# EAGLE design LCDModule_328p (EAGLE 7.1.0)
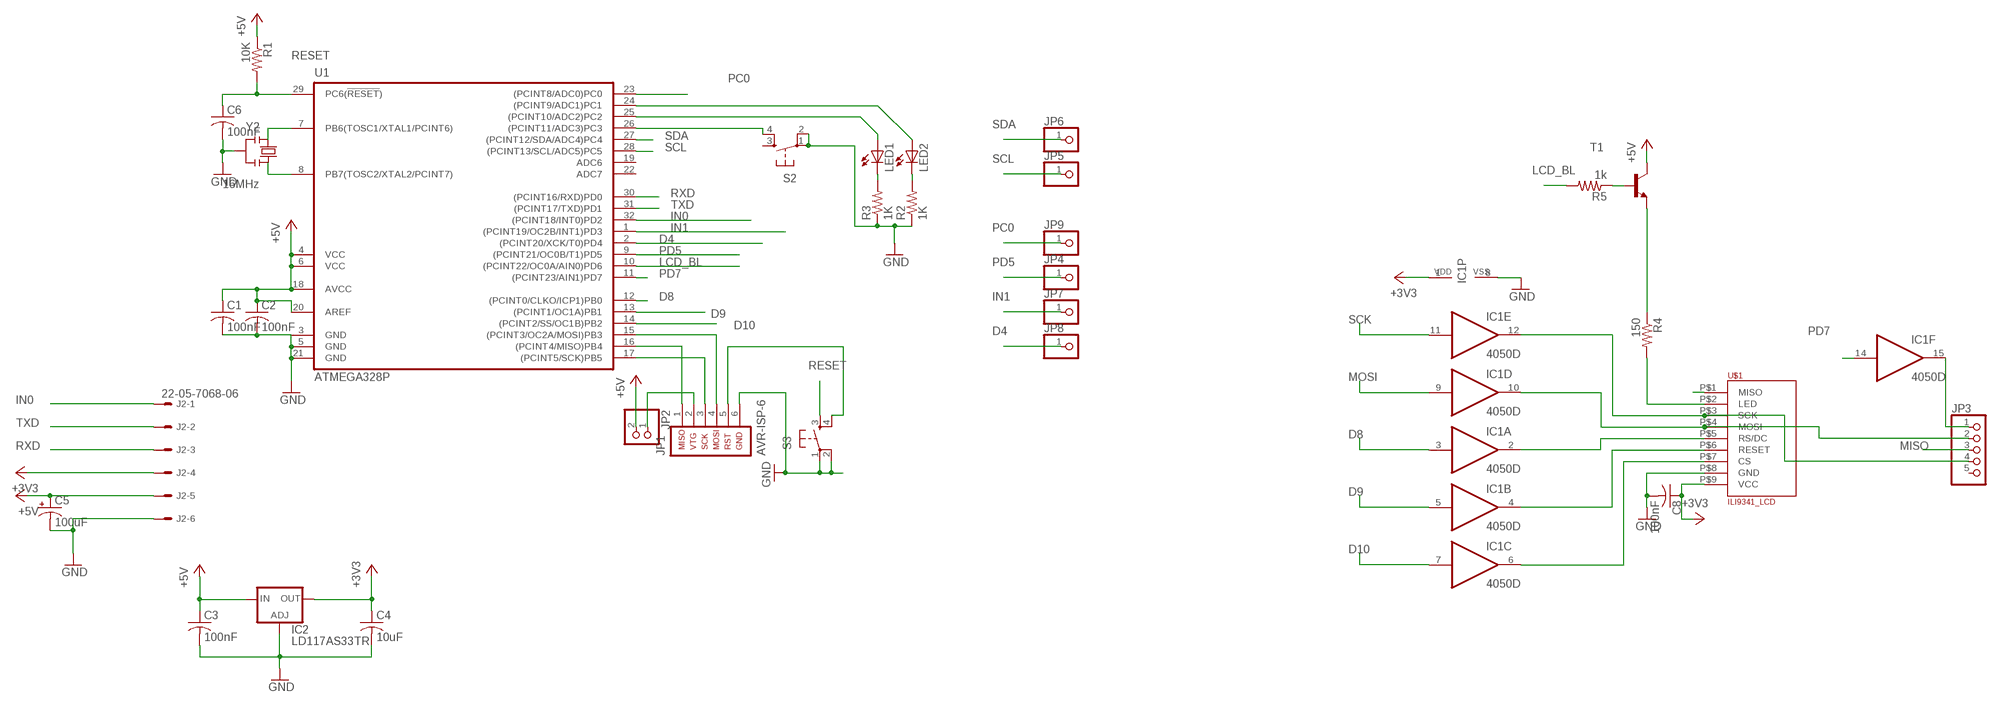
[diagram p0: schematic, sheet 1]

## Parts
C1  100nF  C-USC0805K  [C0805K]
C2  100nF  C-USC0805K  [C0805K]
C3  100nF  C-USC0805K  [C0805K]
C4  10uF  C-USC0805K  [C0805K]
C5  100uF  CPOL-USD  [PANASONIC_D]
C6  100nF  C-USC0805K  [C0805K]
C8  100nF  C-USC0805K  [C0805K]
IC1  4050D  [SO16]
IC2  LD117AS33TR  [SOT223]
J2  22-05-7068-06  [7395-06]
JP1  AVR-ISP-6  [AVR-ISP-6]
JP2  PINHD-1X2  [1X02]
JP3  PINHD-1X5  [1X05]
JP4  PINHD-1X1  [1X01]
JP5  PINHD-1X1  [1X01]
JP6  PINHD-1X1  [1X01]
JP7  PINHD-1X1  [1X01]
JP8  PINHD-1X1  [1X01]
JP9  PINHD-1X1  [1X01]
LED1  LEDCHIPLED_0805  [CHIPLED_0805]
LED2  LEDCHIPLED_0805  [CHIPLED_0805]
R1  10K  R-US_R0805  [R0805]
R2  1K  R-US_R0805  [R0805]
R3  1K  R-US_R0805  [R0805]
R4  150  R-US_R0805  [R0805]
R5  1k  R-US_R0805  [R0805]
S2  TAC_SWITCHSMD  [TACTILE_SWITCH_SMD]
S3  TAC_SWITCHSMD  [TACTILE_SWITCH_SMD]
T1  MMBT2222ALT1-NPN-SOT23-BEC  [SOT23-BEC]
U1  ATMEGA328P  ATMEGA48P/88P/168P/328P-A  [TQFP32A]
U$1  ILI9341_LCD  [SIL1X9]
Y2  16MHz  RESONATORMU  [RESONATOR]

## Nets
+3V3: C4.1 C8.1 IC1.1(P:VDD) IC2.4(OUT) J2.4 U$1.P$9(VCC)
+5V: C1.1 C2.1 C3.1 C5.+ IC2.3(IN) J2.5 JP2.2 R1.1 T1.C U1.4(VCC) U1.6(VCC) U1.18(AVCC) U1.20(AREF)
D4: JP8.1 U1.2((PCINT20/XCK/T0)PD4)
D8: IC1.3(A:I) U1.12((PCINT0/CLKO/ICP1)PB0)
D9: IC1.5(B:I) U1.13((PCINT1/OC1A)PB1)
D10: IC1.7(C:I) U1.14((PCINT2/SS/OC1B)PB2)
GND: C1.2 C2.2 C3.2 C4.2 C5.- C6.2 C8.2 IC1.8(P:VSS) IC2.1(ADJ) J2.6 JP1.6 R2.1 R3.1 S2.1 S2.2 S3.1 S3.2 U1.5(GND) U1.21(GND) U$1.P$8(GND) Y2.2
IN0: J2.1 U1.32((PCINT18/INT0)PD2)
IN1: JP7.1 U1.1((PCINT19/OC2B/INT1)PD3)
LCD_BL: R5.2 U1.10((PCINT22/OC0A/AIN0)PD6)
MISO: JP1.1 JP3.3 U1.16((PCINT4/MISO)PB4)
MOSI: IC1.9(D:I) JP1.4 U1.15((PCINT3/OC2A/MOSI)PB3)
N$1: R5.1 T1.B
N$2: LED2.A U1.24((PCINT9/ADC1)PC1)
N$3: LED1.A U1.25((PCINT10/ADC2)PC2)
N$4: S2.4 U1.26((PCINT11/ADC3)PC3)
N$5: IC1.12(E:O) JP3.4 U$1.P$3(SCK)
N$6: IC1.10(D:O) JP3.2 U$1.P$4(MOSI)
N$7: U$1.P$1(MISO)
N$8: IC1.2(A:O) U$1.P$5(RS/DC)
N$9: U1.8(PB7(TOSC2/XTAL2/PCINT7)) Y2.3
N$10: U1.7(PB6(TOSC1/XTAL1/PCINT6)) Y2.1
N$12: LED2.C R2.2
N$13: LED1.C R3.2
N$14: IC1.4(B:O) U$1.P$6(RESET)
N$15: IC1.6(C:O) U$1.P$7(CS)
N$16: IC1.15(F:O) JP3.1
N$17: R4.1 T1.E
N$18: R4.2 U$1.P$2(LED)
N$19: JP1.5 S3.4
N$20: JP1.2 JP2.1
PC0: JP9.1 U1.23((PCINT8/ADC0)PC0)
PD5: JP4.1 U1.9((PCINT21/OC0B/T1)PD5)
PD7: IC1.14(F:I) U1.11((PCINT23/AIN1)PD7)
RESET: C6.1 R1.2 S3.3 U1.29(PC6(!RESET!))
RXD: J2.3 U1.30((PCINT16/RXD)PD0)
SCK: IC1.11(E:I) JP1.3 U1.17((PCINT5/SCK)PB5)
SCL: JP5.1 U1.28((PCINT13/SCL/ADC5)PC5)
SDA: JP6.1 U1.27((PCINT12/SDA/ADC4)PC4)
TXD: J2.2 U1.31((PCINT17/TXD)PD1)
Unconnected: JP3.5 S2.3 U1.19(ADC6) U1.22(ADC7)

## Power pins joined to a net without a drawn wire
GND: U1.3(GND)

## Library data of the parts
C1-C4 C6 C8 = resistor:C-US: CAPACITOR, American symbol
C5 = resistor:CPOL-US: POLARIZED CAPACITOR, American symbol
IC1 = 40xx:4050: Hex non-inverting BUFFER
IC2 = v-reg:LD117A?*: Low drop fixed and adjustable positive voltage regulators 1 A Source: http://www.st.com/stonline/products/literature/ds/7194/ld1117axx.pdf
J2 = con-molex:22-?-06: CONNECTOR wire to board 2.54 mm (.1 inch) pitch header; OC_FARNELL: unknown; OC_NEWARK: unknown
JP1 = atmel:AVR-ISP-6: AVR ISP-6 Serial Programming Header
JP2 = pinhead:PINHD-1X2: PIN HEADER
JP3 = pinhead:PINHD-1X5: PIN HEADER
JP4-JP9 = pinhead:PINHD-1X1: PIN HEADER
LED1 LED2 = led:LED: LED OSRAM: - CHIPLED LG R971, LG N971, LY N971, LG Q971, LY Q971, LO R971, LY R971 LH N974, LH R974 LS Q976, LO Q976, LY Q976 LO Q996 - Hyper CHIPLED LW Q18S LB Q993, LB Q99A, LB R99A - SideLED LS A670, LO A670, LY A670, LG A670, LP A670 LB A673, LV A673, LT A673, LW A673 LH A674 LY A675 LS A676, LA A676, LO A676, LY A676, LW A676 LS A679, LY A679, LG A679 - Hyper Micro SIDELED® LS Y876, LA Y876, LO Y876, LY Y876 LT Y87S - SmartLED LW L88C, LW L88S LB L89C, LB L89S, LG L890 LS L89K, LO L89K, LY L89K LS L896, LA L896, LO L896, LY L896 - TOPLED LS T670, LO T670, LY T670, LG T670, LP T670 LSG T670, LSP T670, LSY T670, LOP T670, LYG T670 LG T671, LOG T671, LSG T671 LB T673, LV T673, LT T673, LW T673 LH T674 LS T676, LA T676, LO T676, LY T676, LB T676, LH T676, LSB T676, LW T676 LB T67C, LV T67C, LT T67C, LS T67K, LO T67K, LY T67K, LW E67C LS E67B, LA E67B, LO E67B, LY E67B, LB E67C, LV E67C, LT E67C LW T67C LS T679, LY T679, LG T679 LS T770, LO T770, LY T770, LG T770, LP T770 LB T773, LV T773, LT T773, LW T773 LH T774 LS E675, LA E675, LY E675, LS T675 LS T776, LA T776, LO T776, LY T776, LB T776 LHGB T686 LT T68C, LB T68C - Hyper Mini TOPLED® LB M676 - Mini TOPLED Santana® LG M470 LS M47K, LO M47K, LY M47K Source: http://www.osram.convergy.de LUXEON: - LUMILED® LXK2-PW12-R00, LXK2-PW12-S00, LXK2-PW14-U00, LXK2-PW14-V00 LXK2-PM12-R00, LXK2-PM12-S00, LXK2-PM14-U00 LXK2-PE12-Q00, LXK2-PE12-R00, LXK2-PE12-S00, LXK2-PE14-T00, LXK2-PE14-U00 LXK2-PB12-K00, LXK2-PB12-L00, LXK2-PB12-M00, LXK2-PB14-N00, LXK2-PB14-P00, LXK2-PB14-Q00 LXK2-PR12-L00, LXK2-PR12-M00, LXK2-PR14-Q00, LXK2-PR14-R00 LXK2-PD12-Q00, LXK2-PD12-R00, LXK2-PD12-S00 LXK2-PH12-R00, LXK2-PH12-S00 LXK2-PL12-P00, LXK2-PL12-Q00, LXK2-PL12-R00 Source: www.luxeon.com KINGBRIGHT: KA-3528ASYC Source: www.kingbright.com
R1-R5 = resistor:R-US_: RESISTOR, American symbol
S2 S3 = SparkFun:TAC_SWITCH: Momentary Switch Button commonly used for reset or general input. Spark Fun Electronics SKU : COM-00097
T1 = transistor-neu-to92:*-NPN-: NPN Transistror
U1 = atmel-avr:ATMEGA48P/88P/168P/328P: MICROCONTROLLER 4/8/16/32K Flash
U$1 = RobThePyro:ILI9341_LCD
Y2 = SmartPrj:RESONATOR

## Net classes
0 default: width 0.152 mm, drill 0.305 mm, clearance 0.152 mm

## Board
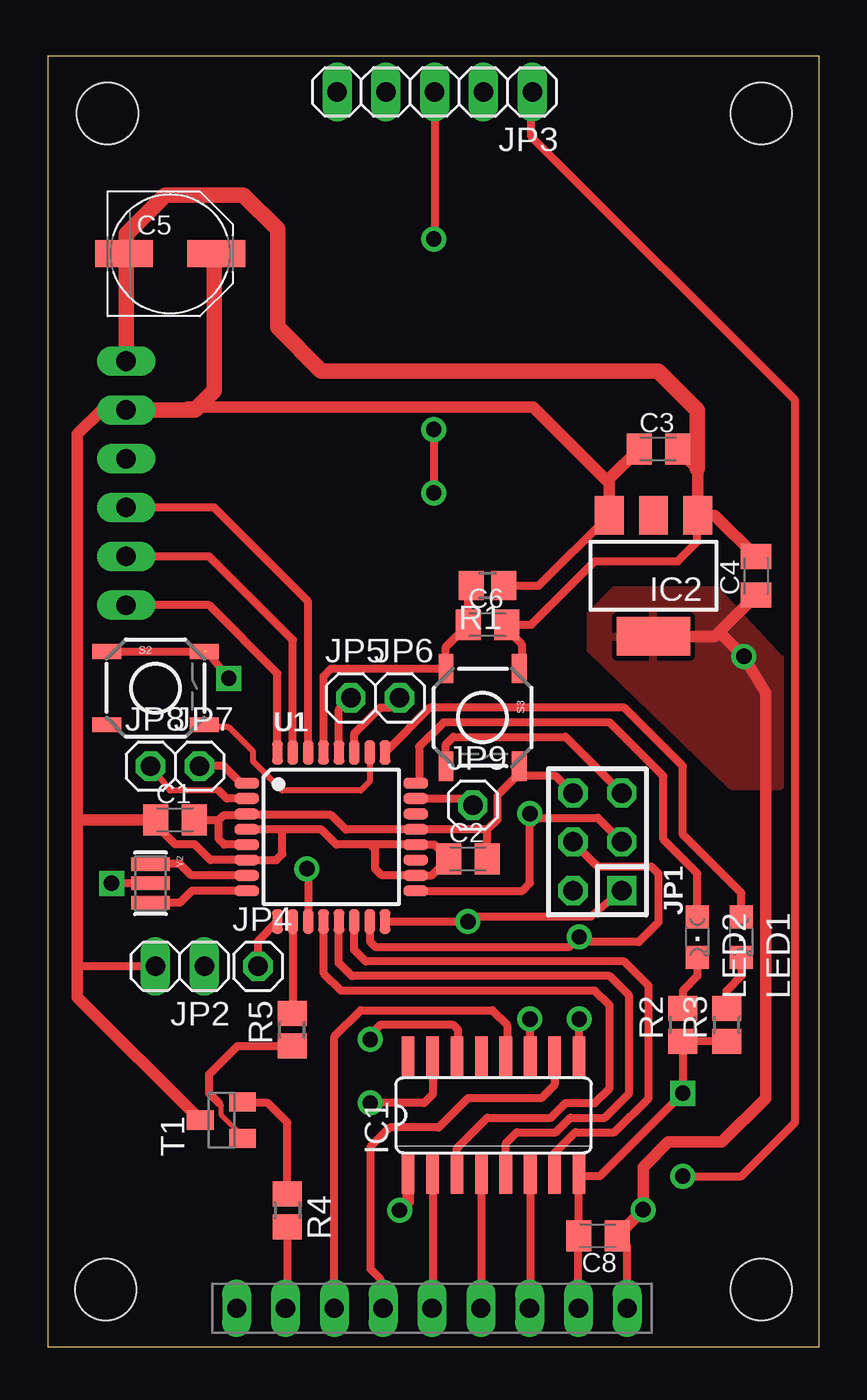
[diagram p1: board, top side]
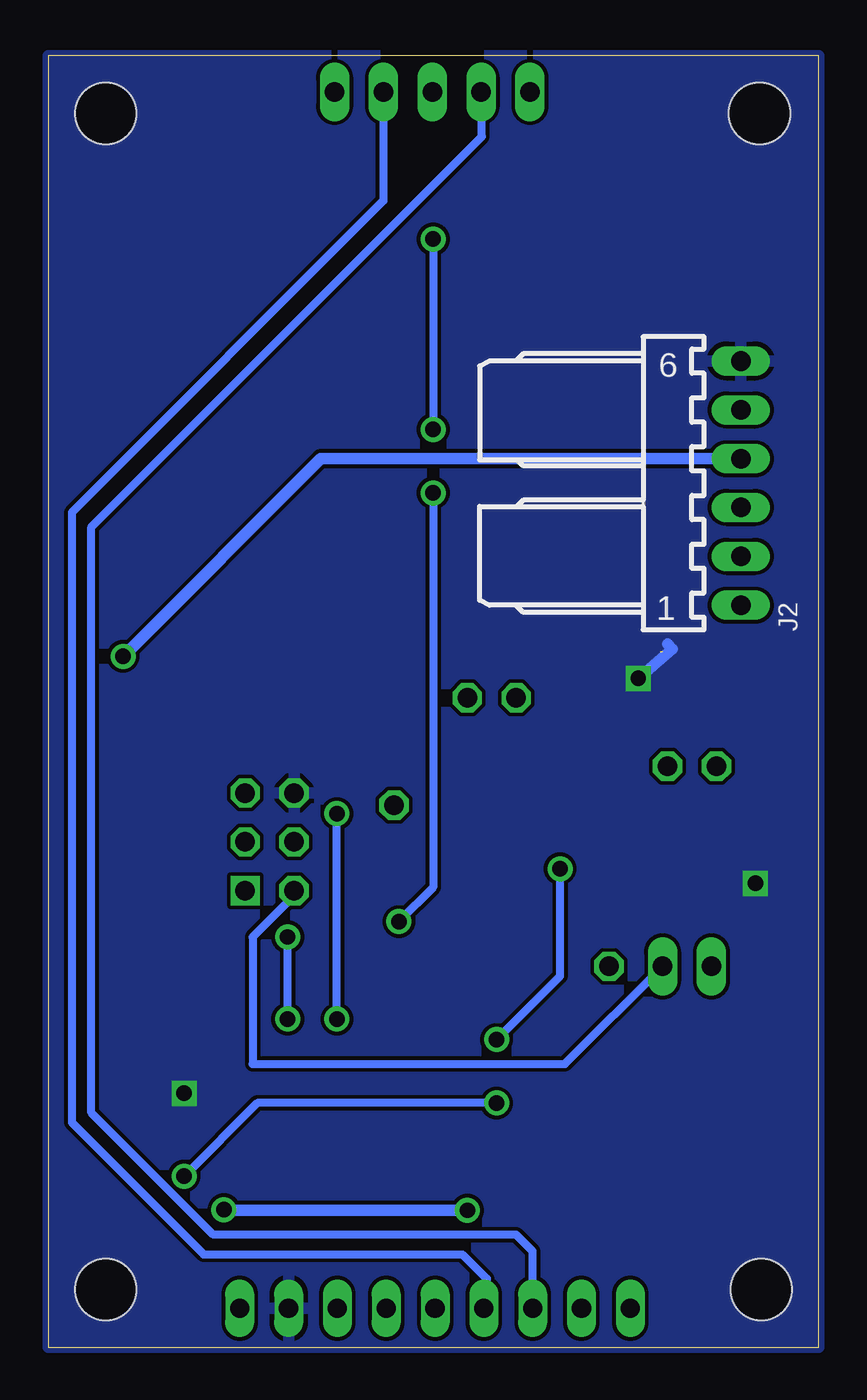
[diagram p2: board, bottom side, seen from below]

Size 40.1 x 67.2 mm. Coordinates in mm from the lower left corner, seen from the top.
Outline: 0,0 0,67.2 40.1,67.2 40.1,0 0,0
Copper layers (1*16): Top 0.035mm / dielectric 0mil / Bottom 0.035mm
Design rules "Master Circuits": minimum track width 0.2mm, minimum drill 0.4mm, track to track 0.2mm, track to pad 0.2mm, pad to pad 0.2mm, via to via 0.2mm, smd to smd 0.2mm, copper to edge 0mil, drill to drill 8mil, minimum pad ring 0.25mm, minimum via ring 0.25mm, stop-mask expansion 4mil, vias tented up to drill 0mil, thermal gap 10mil
Holes 3.2 mm at 3,3 37.1,3 37.1,64.2 3.1,64.2

### Footprints (pad centres in the part's own frame; a part is rotated, then mirrored left to right if it is on the bottom)
C0805K = smd 1.3 x 1.6: 1 -1,0; 2 1,0
PANASONIC_D = smd 3 x 1.4: + 2.4,0; - -2.4,0
SO16 = smd 0.66 x 2.032: 1 -4.445,-3.073; 2 -3.175,-3.073; 3 -1.905,-3.073; 4 -0.635,-3.073; 5 0.635,-3.073; 6 1.905,-3.073; 7 3.175,-3.073; 8 4.445,-3.073; 9 4.445,3.073; 10 3.175,3.073; 11 1.905,3.073; 12 0.635,3.073; 13 -0.635,3.073; 14 -1.905,3.073; 15 -3.175,3.073; 16 -4.445,3.073
SOT223 = smd 1.5 x 2: 1 -2.3,-3.15; 2 0,-3.15; 3 2.3,-3.15 | smd 3.8 x 2: 4 0,3.15
7395-06 = drill 1.016 long: 1 6.35,0; 2 3.81,0; 3 1.27,0; 4 -1.27,0; 5 -3.81,0; 6 -6.35,0
AVR-ISP-6 = drill 1.016 square: 1 -2.54,-1.27 | drill 1.016 octagon: 2 -2.54,1.27; 3 0,-1.27; 4 0,1.27; 5 2.54,-1.27; 6 2.54,1.27
1X02 = drill 1.016 long: 1 -1.27,0; 2 1.27,0
1X05 = drill 1.016 long: 1 -5.08,0; 2 -2.54,0; 3 0,0; 4 2.54,0; 5 5.08,0
1X01 = drill 1.016 octagon: 1 0,0
CHIPLED_0805 = smd 1.2 x 1.2: A 0,-1.05; C 0,1.05
R0805 = smd 1.3 x 1.5: 1 -0.85,0; 2 0.85,0
TACTILE_SWITCH_SMD = smd 1.524 x 0.762: 1 -2.54,1.905; 2 2.54,1.905; 3 -2.54,-1.905; 4 2.54,-1.905
SOT23-BEC = smd 1 x 1.4: B -0.95,-1.1; C 0,1.1; E 0.95,-1.1
TQFP32A = smd 1.27 x 0.559: 1 -4.4,2.8; 2 -4.4,2; 3 -4.4,1.2; 4 -4.4,0.4; 5 -4.4,-0.4; 6 -4.4,-1.2; 7 -4.4,-2; 8 -4.4,-2.8; 17 4.4,-2.8; 18 4.4,-2; 19 4.4,-1.2; 20 4.4,-0.4; 21 4.4,0.4; 22 4.4,1.2; 23 4.4,2; 24 4.4,2.8 | smd 0.559 x 1.27: 9 -2.8,-4.4; 10 -2,-4.4; 11 -1.2,-4.4; 12 -0.4,-4.4; 13 0.4,-4.4; 14 1.2,-4.4; 15 2,-4.4; 16 2.8,-4.4; 25 2.8,4.4; 26 2,4.4; 27 1.2,4.4; 28 0.4,4.4; 29 -0.4,4.4; 30 -1.2,4.4; 31 -2,4.4; 32 -2.8,4.4
SIL1X9 = drill 1 long: P$1 -10.16,0; P$2 -7.62,0; P$3 -5.08,0; P$4 -2.54,0; P$5 0,0; P$6 2.54,0; P$7 5.08,0; P$8 7.62,0; P$9 10.16,0
RESONATOR = smd 0.7 x 2: 1 -1,0; 2 0,0; 3 1,0

### Placement (x,y rotation side)
C1  6.6,27.43 0 top
C2  21.84,25.4 0 top
C3  31.75,46.74 0 top
C4  36.83,40.13 90 top
C5  6.35,56.9 0 top
C6  22.86,37.59 0 top
C8  28.6,5.79 180 top
IC1  23.18,12.06 0 top
IC2  31.5,40.13 180 top
J2  4.06,44.96 270 bottom
JP1  28.57,26.29 90 top
JP2  6.86,19.81 180 top
JP3  20.11,65.31 180 top
JP4  10.92,19.81 0 top
JP5  15.75,33.78 0 top
JP6  18.29,33.78 0 top
JP7  7.87,30.23 0 top
JP8  5.33,30.23 0 top
JP9  22.1,28.19 0 top
LED1  36.07,21.34 180 top
LED2  33.78,21.34 180 top
R1  22.86,39.62 180 top
R2  33.02,16.76 90 top
R3  35.31,16.76 90 top
R4  12.45,7.11 270 top
R5  12.7,16.51 90 top
S2  5.59,34.29 0 top
S3  22.61,32.77 270 top
T1  9.02,11.81 90 top
U1  14.73,26.54 0 top
U$1  19.97,2.02 0 top
Y2  5.33,24.13 270 top

### Tracks (layer width: path | path; a pad name or v marks a point on that pad's centre or on a via)
+3V3  (via drill 0.8)
  Top 0.406: U$1.P$9 30.13,5.26 C8.1
  Top 0.61: C4.1 34.92,37.22 | 34.92,37.22 34.68,36.98 IC2.4 | C8.1 v30.95,7.14 30.95,9.37 32.26,10.67 35.05,10.67 37.34,12.95 37.34,34.04 v36.2,35.94 34.92,37.22 | IC1.1 18.73,7.56 v18.29,7.11
  Bottom 0.61: v18.29,7.11 30.92,7.11 v30.95,7.14 | J2.4 25.91,46.23 v36.2,35.94
  pour Top: 28.19,38.1 28.19,36.32 35.56,29.21 38.1,29.21 38.1,35.81 34.8,39.37 29.46,39.37
+5V
  Top 0.406: 16.76,26.14 U1.20 20.1,26.14 C2.1 | 16.76,26.14 15.01,26.14 14.22,26.92 12.19,26.92 | 12.19,26.92 10.35,26.92 U1.4 | 16.76,26.14 17.02,25.89 17.02,24.89 17.37,24.54 U1.18 19.97,24.54 20.83,25.4 | 12.19,26.92 12.19,25.65 11.88,25.34 U1.6 8.44,25.34 7.62,26.16 6.6,26.16 5.84,26.92 5.84,27.7 C1.1 | R1.1 25.54,39.62 IC2.3 | JP2.2 1.52,19.81
  Top 0.61: IC2.3 29.2,44.96 | 29.2,44.96 29.2,45.18 C3.1 | T1.C 1.52,18.2 1.52,19.81 1.52,27.43 | 1.52,27.43 1.52,47.5 2.79,48.77 J2.5 | C1.1 1.52,27.43 | 7.11,48.77 7.25,48.91 25.25,48.91 29.2,44.96
  Top 0.813: J2.5 7.11,48.77 7.62,48.77 8.64,49.78 8.64,56.78 C5.+
D4
  Top 0.305: 8.89,28.96 6.35,28.96 JP8.1
  Top 0.406: U1.2 9.3,28.54 8.89,28.96
D8
  Top 0.406: IC1.3 21.27,10.35 22.86,11.94 26.16,11.94 26.92,12.7 28.45,12.7 29.21,13.46 29.21,17.78 28.45,18.54 15.24,18.54 14.35,19.43 14.35,22.12 U1.12
D9
  Top 0.406: IC1.5 23.81,10.6 24.38,11.18 26.42,11.18 27.18,11.94 28.96,11.94 30.23,13.21 30.23,18.29 29.21,19.3 15.8,19.3 15.11,19.99 15.11,22.12 U1.13
D10
  Top 0.406: IC1.7 26.35,10.1 27.43,11.18 29.46,11.18 31.24,12.95 31.24,18.8 29.97,20.07 16.54,20.07 15.93,20.68 U1.14
GND  (via drill 0.8)  (1 unrouted)
  Top 0.406: JP1.6 26.42,29.72 24.64,29.72 | 24.64,29.72 24.38,29.72 23.37,28.7 23.37,27.43 22.86,26.92 | 22.86,26.92 19.15,26.92 | 19.15,26.92 U1.21 | U$1.P$8 C8.2 27.6,8.97 IC1.8 27.72,8.89 28.7,8.89 v33.02,13.21 R2.1 R3.1 | 19.15,26.92 15.49,26.92 14.73,27.69 10.39,27.69 U1.3 10.28,27.69 9.14,27.69 8.89,27.43 | U1.5 9.16,26.14 8.89,26.42 8.89,27.43 | C2.2 22.84,26.91 22.86,26.92 | C1.2 8.89,27.43 | Y2.2 v3.3,24.13 | S3.2 24.51,29.84 24.64,29.72 | S3.1 24.64,35.43 24.64,36.58 23.86,37.35 C6.2 25.15,37.59 28.45,40.89 32.77,40.89 33.78,41.91 33.78,43.27 IC2.1 | S2.1 8.26,36.2 v9.4,34.8
  Top 0.61: C3.2 33.77,45.71 33.8,45.69 IC2.1 34.68,43.28 C4.2
  Top 0.813: J2.6 4.06,56.78 | 4.06,56.78 C5.- | 4.06,56.78 4.06,57.91 6.1,59.94 10.16,59.94 11.94,58.17 11.94,53.09 14.22,50.8 31.75,50.8 33.78,48.77 33.78,45.72 33.77,45.71
  Bottom 0.406: v3.3,24.13 3.05,24.13 | v33.02,13.21 33.27,13.46
  Bottom 0.61: v9.4,34.8 7.62,36.32 7.87,36.58
  pour Bottom: 0,0 0,67.2 40.1,67.2 40.1,0
IN0
  Top 0.406: U1.32 11.93,35.06 8.38,38.61 J2.1
IN1
  Top 0.406: U1.1 10.03,29.34 9.14,30.23 JP7.1
LCD_BL
  Top 0.406: U1.10 12.73,17.39 R5.2
MISO  (via drill 0.8)
  Top 0.406: U1.16 v21.84,22.14 22.35,22.4 28.24,22.4 JP1.1 | JP3.3 20.11,57.7 v20.07,57.66 | v20.07,47.75 v20.07,44.45
  Bottom 0.406: v20.07,57.66 v20.07,47.75 | v20.07,44.45 20.07,23.92 v21.84,22.14
MOSI  (via drill 0.8)
  Top 0.406: IC1.9 27.62,17.06 v27.64,17.07 | U1.15 16.76,22.11 16.76,21.08 17.02,20.83 27.12,20.83 v27.64,21.34 27.69,21.08 30.73,21.08 31.75,22.1 31.75,24.64 31.39,25 28.6,25 28.45,25.15 JP1.4
  Bottom 0.406: v27.64,17.07 v27.64,21.34
N$1
  Top 0.254: T1.B 10.12,10.96 9.02,12.06 9.02,12.57 8.89,12.7
  Top 0.406: 8.89,12.7 8.38,13.21 8.38,14.2 9.86,15.67 12.69,15.67 R5.1
N$2
  Top 0.406: LED2.A 33.78,24.64 32,26.42 32,29.72 29.21,32.51 20.57,32.51 19.3,31.24 19.3,29.52 U1.24
N$3
  Top 0.406: LED1.A 36.07,23.62 33.02,26.67 33.02,30.23 29.97,33.27 19.86,33.27 U1.25
N$4
  Top 0.305: U1.26 16.73,29.43 16.26,28.96 12.19,28.96 10.67,30.48 10.67,30.99 9.4,32.26 8,32.26 S2.4
N$5
  Top 0.406: U$1.P$3 14.89,16.16 16.26,17.53 23.11,17.53 23.88,16.76 23.88,15.2 IC1.12
  Bottom 0.406: U$1.P$3 14.89,4.98 15.75,5.84 31.5,5.84 37.85,12.19 37.85,42.67 17.53,62.99 17.53,65.27 JP3.4
N$6
  Top 0.406: IC1.10 26.35,13.65 25.65,12.95 21.84,12.95 20.32,11.43 17.78,11.43 16.76,10.41 16.76,4.06 17.27,3.56 17.27,2.18 U$1.P$4
  Bottom 0.406: JP3.2 22.65,59.64 38.86,43.43 38.86,11.68 32,4.83 18.54,4.83 17.27,3.56 17.27,2.18 U$1.P$4
N$8
  Top 0.406: IC1.2 20,2.05 U$1.P$5
N$9
  Top 0.406: U1.8 7.49,23.74 6.86,23.11 4.59,23.11 Y2.3
N$10
  Top 0.406: U1.7 7.46,24.54 6.86,25.15 4.59,25.15 Y2.1
N$12
  Top 0.406: LED2.C 33.78,19.3 33.02,18.54 R2.2
N$13
  Top 0.406: LED1.C 36.07,19.3 35.31,18.54 R3.2
N$14
  Top 0.406: IC1.4 22.54,2.05 U$1.P$6
N$15
  Top 0.406: IC1.6 25.08,2.05 U$1.P$7
N$16  (via drill 0.8)
  Top 0.406: IC1.15 20,13.14 19.56,12.7 v16.76,12.7 | v33.02,8.89 36.07,8.89 38.86,11.68 38.86,49.28 25.15,62.99 25.15,65.27 JP3.1
  Bottom 0.406: v16.76,12.7 29.21,12.7 v33.02,8.89
N$17
  Top 0.406: R4.1 12.45,11.68 11.43,12.7 10.18,12.7 T1.E
N$18
  Top 0.406: R4.2 12.45,2.12 U$1.P$2
N$19
  Top 0.406: S3.4 20.7,31.37 21.08,31.75 26.92,31.75 JP1.5
N$20
  Bottom 0.406: JP1.2 27.3,23.5 29.46,21.34 29.46,14.73 13.21,14.73 JP2.1
PC0
  Top 0.406: U1.23 21.75,28.54 JP9.1
PD5
  Top 0.406: JP4.1 10.92,21.13 U1.9
PD7  (via drill 0.8)
  Top 0.406: IC1.14 21.34,15.2 21.34,16.51 21.08,16.76 17.27,16.76 16.76,16.26 v16.76,16 | v13.46,24.89 13.53,24.82 U1.11
  Bottom 0.406: v16.76,16 13.46,19.3 v13.46,24.89
RESET
  Top 0.406: U1.29 14.33,34.91 14.73,35.31 S3.3 20.7,36.43 C6.1 21.86,39.47 R1.2
RXD
  Top 0.406: U1.30 13.53,38.79 8.64,43.69 J2.3
SCK  (via drill 0.8)
  Top 0.406: U1.17 24.68,23.74 25.07,24.13 25.07,27.18 | JP1.3 28.6,27.53 25.43,27.53 25.07,27.18 | IC1.11 25.08,17.06 v25.07,17.07 | 25.07,27.18 v25.07,27.76
  Bottom 0.406: v25.07,17.07 v25.07,27.76
SCL
  Top 0.406: U1.28 15.13,33.17 JP5.1
SDA
  Top 0.406: U1.27 15.93,31.93 17.27,33.27 17.78,33.27 JP6.1
TXD
  Top 0.406: U1.31 12.73,36.8 8.38,41.15 J2.2